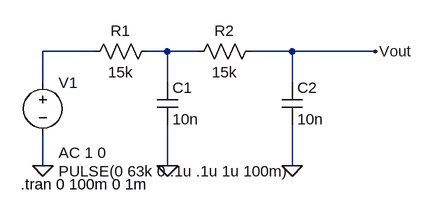
[diagram p0: schematic Lab1_2.asc]
Lab1_2.asc, the LTspice schematic file:
Version 4
SHEET 1 880 680
WIRE 112 112 32 112
WIRE 224 112 192 112
WIRE 272 112 224 112
WIRE 416 112 352 112
WIRE 544 112 416 112
WIRE 32 160 32 112
WIRE 224 160 224 112
WIRE 416 160 416 112
WIRE 32 288 32 240
WIRE 224 288 224 224
WIRE 416 288 416 224
FLAG 32 288 0
FLAG 224 288 0
FLAG 416 288 0
FLAG 544 112 Vout
SYMBOL voltage 32 144 R0
WINDOW 3 24 152 Left 2
WINDOW 123 24 124 Left 2
WINDOW 39 0 0 Left 0
SYMATTR InstName V1
SYMATTR Value PULSE(0 63k 0 .1u .1u 1u 100m)
SYMATTR Value2 AC 1 0
SYMBOL res 208 96 R90
WINDOW 0 0 56 VBottom 2
WINDOW 3 32 56 VTop 2
SYMATTR InstName R1
SYMATTR Value 15k
SYMBOL res 368 96 R90
WINDOW 0 0 56 VBottom 2
WINDOW 3 32 56 VTop 2
SYMATTR InstName R2
SYMATTR Value 15k
SYMBOL cap 208 160 R0
SYMATTR InstName C1
SYMATTR Value 10n
SYMBOL cap 400 160 R0
SYMATTR InstName C2
SYMATTR Value 10n
TEXT -2 316 Left 2 !.tran 0 100m 0 1m

The netlist it stands for:
* Lab1_2.asc
V1 N001 0 PULSE(0 63k 0 .1u .1u 1u 100m) AC 1 0
R1 N002 N001 15k
R2 Vout N002 15k
C1 N002 0 10n
C2 Vout 0 10n
.tran 0 100m 0 1m
.backanno
.end